# EAGLE schematic driver_3KW (EAGLE 6.2)

## Sheet 1 of 2
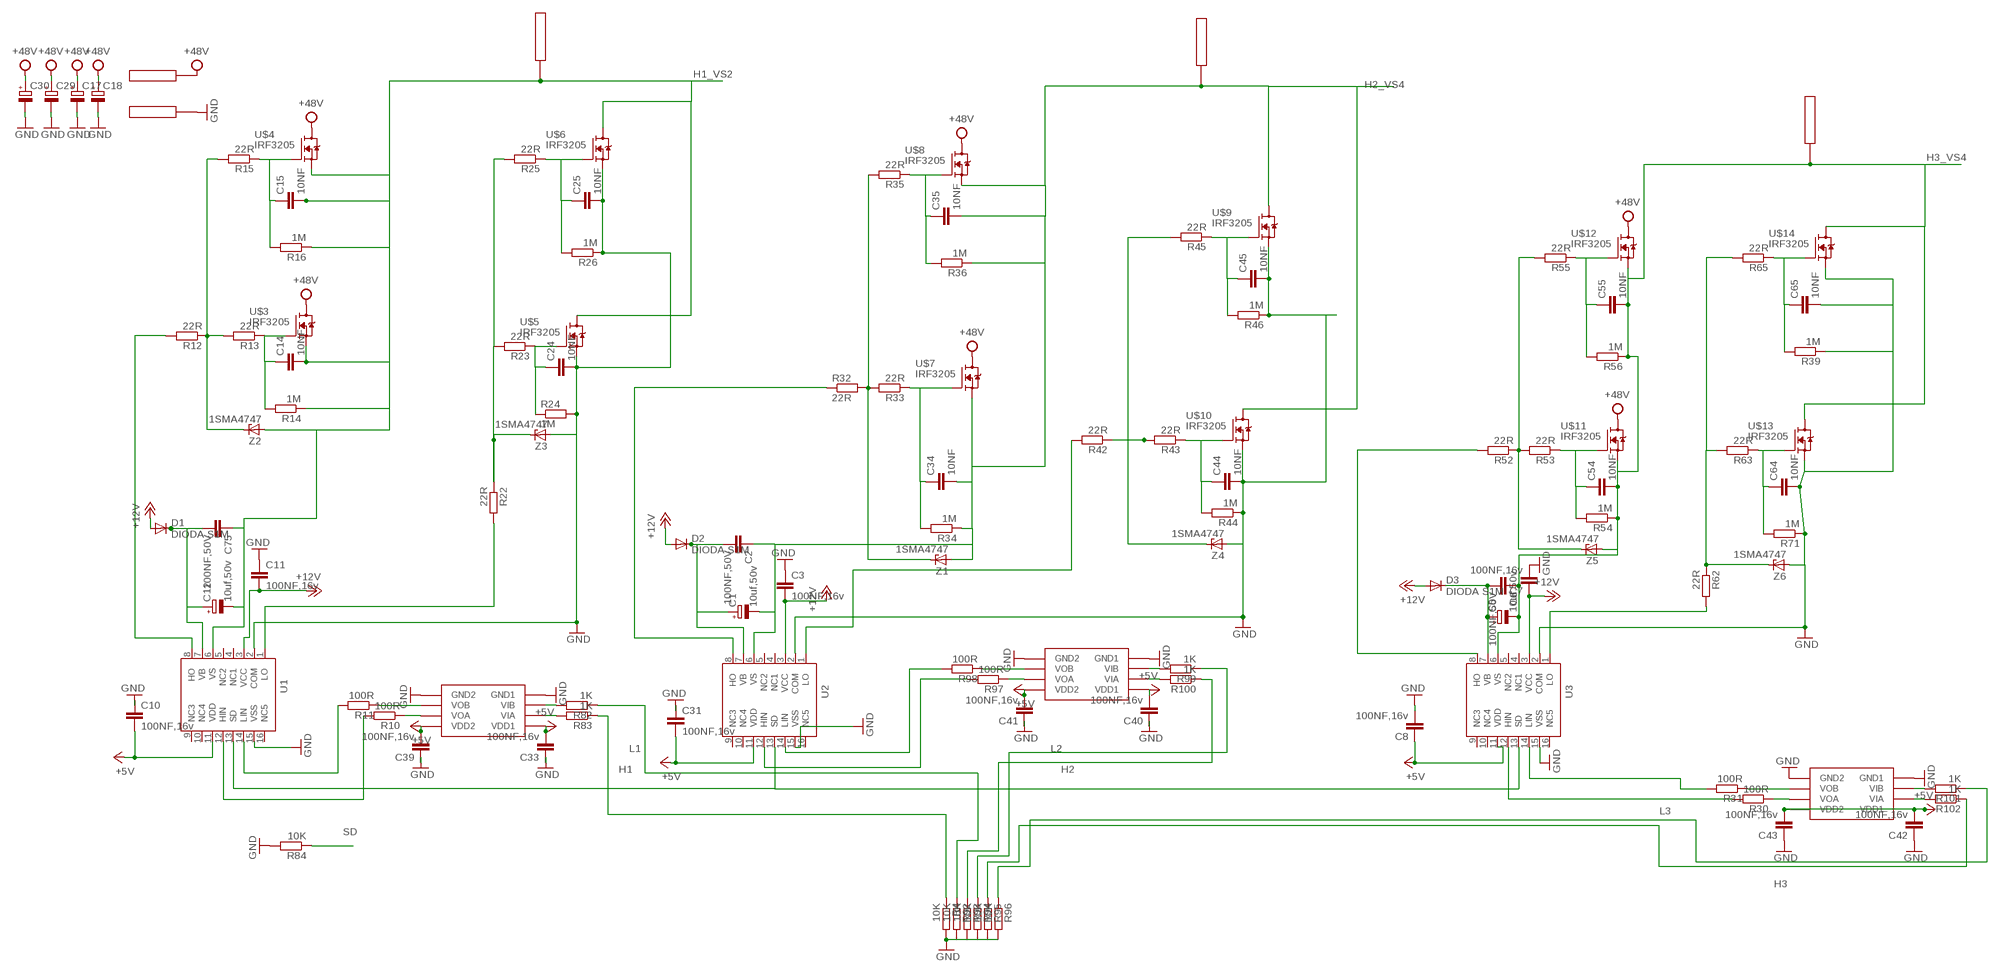
[diagram p0: schematic, sheet 1, part 1 of 2]
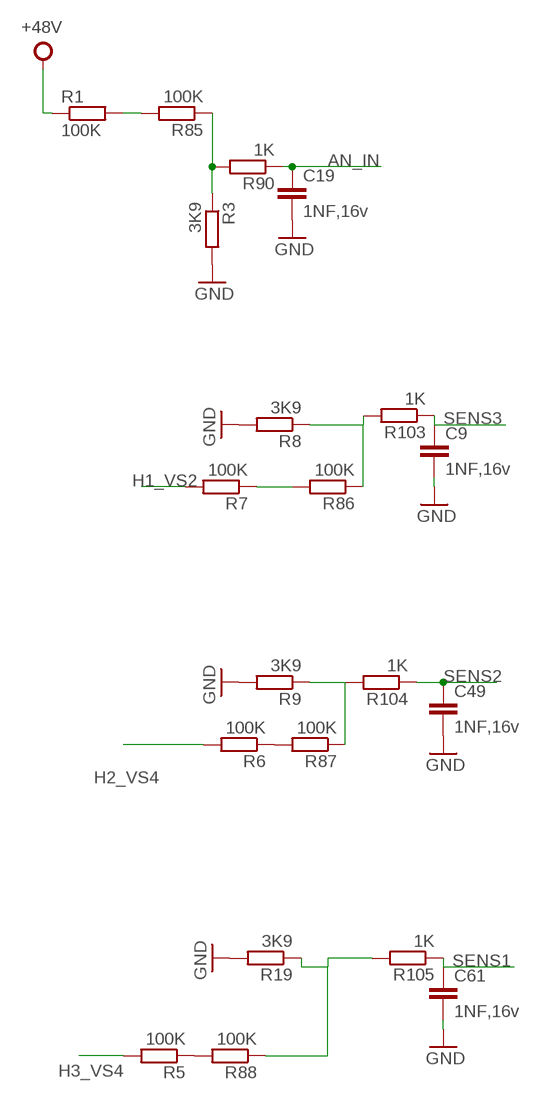
[diagram p1: schematic, sheet 1, part 2 of 2]

### Parts
C1  10uf,50v  CPOL-EUE2.5-5  [E2,5-5]
C2  100NF,50V  C_0805  [C_0805]
C3  100NF,16v  C_0805  [C_0805]
C5  10uf,50v  CPOL-EUE2.5-5  [E2,5-5]
C6  100NF,50V  C_0805  [C_0805]
C7  100NF,16v  C_0805  [C_0805]
C8  100NF,16v  C_0805  [C_0805]
C9  1NF,16v  C_0805  [C_0805]
C10  100NF,16v  C_0805  [C_0805]
C11  100NF,16v  C_0805  [C_0805]
C12  10uf,50v  CPOL-EUE2.5-5  [E2,5-5]
C14  10NF  C_0805  [C_0805]
C15  10NF  C_0805  [C_0805]
C17  CPOL-EUE7.5-16  [E7,5-16]
C18  CPOL-EUE7.5-16  [E7,5-16]
C19  1NF,16v  C_0805  [C_0805]
C24  10NF  C_0805  [C_0805]
C25  10NF  C_0805  [C_0805]
C29  CPOL-EUE7.5-16  [E7,5-16]
C30  CPOL-EUE7.5-16  [E7,5-16]
C31  100NF,16v  C_0805  [C_0805]
C33  100NF,16v  C_0805  [C_0805]
C34  10NF  C_0805  [C_0805]
C35  10NF  C_0805  [C_0805]
C39  100NF,16v  C_0805  [C_0805]
C40  100NF,16v  C_0805  [C_0805]
C41  100NF,16v  C_0805  [C_0805]
C42  100NF,16v  C_0805  [C_0805]
C43  100NF,16v  C_0805  [C_0805]
C44  10NF  C_0805  [C_0805]
C45  10NF  C_0805  [C_0805]
C49  1NF,16v  C_0805  [C_0805]
C54  10NF  C_0805  [C_0805]
C55  10NF  C_0805  [C_0805]
C61  1NF,16v  C_0805  [C_0805]
C64  10NF  C_0805  [C_0805]
C65  10NF  C_0805  [C_0805]
C75  100NF,50V  C_0805  [C_0805]
D1  DIODA S1M  DIODE-DO-214AC  [DO-214AC]
D2  DIODA S1M  DIODE-DO-214AC  [DO-214AC]
D3  DIODA S1M  DIODE-DO-214AC  [DO-214AC]
R1  100K  R-EU_R1206X  [1206X]
R3  3K9  R-EU_R1206X  [1206X]
R4  10K  R_EU  [R_0805]
R5  100K  R-EU_R1206X  [1206X]
R6  100K  R-EU_R1206X  [1206X]
R7  100K  R-EU_R1206X  [1206X]
R8  3K9  R-EU_R1206X  [1206X]
R9  3K9  R-EU_R1206X  [1206X]
R10  100R  R_EU  [R_0805]
R11  100R  R_EU  [R_0805]
R12  22R  R-EU_1210X  [1210X]
R13  22R  R-EU_1210X  [1210X]
R14  1M  R-EU_R1206X  [1206X]
R15  22R  R-EU_1210X  [1210X]
R16  1M  R-EU_R1206X  [1206X]
R19  3K9  R-EU_R1206X  [1206X]
R22  22R  R-EU_1210X  [1210X]
R23  22R  R-EU_1210X  [1210X]
R24  1M  R-EU_R1206X  [1206X]
R25  22R  R-EU_1210X  [1210X]
R26  1M  R-EU_R1206X  [1206X]
R30  100R  R_EU  [R_0805]
R31  100R  R_EU  [R_0805]
R32  22R  R-EU_1210X  [1210X]
R33  22R  R-EU_1210X  [1210X]
R34  1M  R-EU_R1206X  [1206X]
R35  22R  R-EU_1210X  [1210X]
R36  1M  R-EU_R1206X  [1206X]
R39  1M  R-EU_R1206X  [1206X]
R42  22R  R-EU_1210X  [1210X]
R43  22R  R-EU_1210X  [1210X]
R44  1M  R-EU_R1206X  [1206X]
R45  22R  R-EU_1210X  [1210X]
R46  1M  R-EU_R1206X  [1206X]
R52  22R  R-EU_1210X  [1210X]
R53  22R  R-EU_1210X  [1210X]
R54  1M  R-EU_R1206X  [1206X]
R55  22R  R-EU_1210X  [1210X]
R56  1M  R-EU_R1206X  [1206X]
R62  22R  R-EU_1210X  [1210X]
R63  22R  R-EU_1210X  [1210X]
R65  22R  R-EU_1210X  [1210X]
R71  1M  R-EU_R1206X  [1206X]
R82  1K  R_EU  [R_0805]
R83  1K  R_EU  [R_0805]
R84  10K  R_EU  [R_0805]
R85  100K  R-EU_R1206X  [1206X]
R86  100K  R-EU_R1206X  [1206X]
R87  100K  R-EU_R1206X  [1206X]
R88  100K  R-EU_R1206X  [1206X]
R90  1K  R-EU_R1206X  [1206X]
R92  10K  R_EU  [R_0805]
R93  10K  R_EU  [R_0805]
R94  10K  R_EU  [R_0805]
R95  10K  R_EU  [R_0805]
R96  10K  R_EU  [R_0805]
R97  100R  R_EU  [R_0805]
R98  100R  R_EU  [R_0805]
R99  1K  R_EU  [R_0805]
R100  1K  R_EU  [R_0805]
R101  1K  R_EU  [R_0805]
R102  1K  R_EU  [R_0805]
R103  1K  R-EU_R1206X  [1206X]
R104  1K  R-EU_R1206X  [1206X]
R105  1K  R-EU_R1206X  [1206X]
U1  IRS2110  MAX3043CWE  [SO16L]
U2  IRS2110  MAX3043CWE  [SO16L]
U3  IRS2110  MAX3043CWE  [SO16L]
U4  ADUM1200  [SO8]
U5  ADUM1200  [SO8]
U6  ADUM1200  [SO8]
U$3  IRF3205  [TO220AB]
U$4  IRF3205  [TO220AB]
U$5  IRF3205  [TO220AB]
U$6  IRF3205  [TO220AB]
U$7  IRF3205  [TO220AB]
U$8  IRF3205  [TO220AB]
U$9  IRF3205  [TO220AB]
U$10  IRF3205  [TO220AB]
U$11  IRF3205  [TO220AB]
U$12  IRF3205  [TO220AB]
U$13  IRF3205  [TO220AB]
U$14  IRF3205  [TO220AB]
U$15  PINOUT  [1DIP]
U$16  PINOUT  [1DIP]
U$17  PINOUT  [1DIP]
U$18  PINOUT  [1DIP]
U$19  PINOUT  [1DIP]
Z1  1SMA4747  ZENER-DIODESOD80C  [SOD80C@1]
Z2  1SMA4747  ZENER-DIODESOD80C  [SOD80C@1]
Z3  1SMA4747  ZENER-DIODESOD80C  [SOD80C@1]
Z4  1SMA4747  ZENER-DIODESOD80C  [SOD80C@1]
Z5  1SMA4747  ZENER-DIODESOD80C  [SOD80C@1]
Z6  1SMA4747  ZENER-DIODESOD80C  [SOD80C@1]

### Nets
+5V: C8.1 C10.2 C31.2 C33.2 C39.2 C40.2 C41.2 C42.2 C43.2 U1.11(VDD) U2.11(VDD) U3.11(VDD) U4.1(VDD1) U4.8(VDD2) U5.1(VDD1) U5.8(VDD2) U6.1(VDD1) U6.8(VDD2) ; also sheet 2
+12V: C3.2 C7.1 C11.2 D1.A D2.A D3.A U1.3(VCC) U2.3(VCC) U3.3(VCC) ; also sheet 2
+48V: C17.+ C18.+ C29.+ C30.+ R1.P$1 U$3.D U$4.D U$7.D U$8.D U$11.D U$12.D U$18.P$1
AN_IN: C19.1 R90.P$1 ; also sheet 2
GND: C3.1 C7.2 C8.2 C9.2 C10.1 C11.1 C17.- C18.- C19.2 C24.2 C25.2 C29.- C30.- C31.1 C33.1 C39.1 C40.1 C41.1 C42.1 C43.1 C44.2 C45.2 C49.2 C61.2 C64.2 C65.2 R3.P$2 R4.2 R8.P$2 R9.P$2 R19.P$2 R24.P$2 R26.P$1 R39.P$1 R44.P$1 R46.P$1 R71.P$1 R84.2 R92.2 R93.2 R94.2 R95.2 R96.2 U1.2(COM) U1.15(VSS) U2.2(COM) U2.15(VSS) U3.2(COM) U3.15(VSS) U4.4(GND1) U4.5(GND2) U5.4(GND1) U5.5(GND2) U6.4(GND1) U6.5(GND2) U$5.S U$6.S U$9.S U$10.S U$13.S U$14.S U$19.P$1 Z3.A Z4.A Z6.A ; also sheet 2
H1: R4.1 R83.1 ; also sheet 2
H1_VS2: C12.- C14.2 C15.2 C75.1 R7.P$2 R14.P$1 R16.P$1 U1.6(VS) U$3.S U$4.S U$5.D U$6.D U$15.P$1 Z2.A
H2: R93.1 R100.1 ; also sheet 2
H2_VS4: C1.- C2.1 C34.2 C35.2 R6.P$2 R34.P$1 R36.P$1 U2.6(VS) U$7.S U$8.S U$9.D U$10.D U$16.P$1 Z1.A
H3: R95.1 R102.1 ; also sheet 2
H3_VS4: C5.- C6.1 C54.2 C55.2 R5.P$2 R54.P$1 R56.P$1 U3.6(VS) U$11.S U$12.S U$13.D U$14.D U$17.P$1 Z5.A
L1: R82.1 R92.1 ; also sheet 2
L2: R94.1 R99.1 ; also sheet 2
L3: R96.1 R101.1 ; also sheet 2
N$1: R52.P$1 R53.P$2 R55.P$2 Z5.C
N$7: R9.P$1 R87.P$1 R104.P$2
N$12: C35.1 R35.P$1 R36.P$2 U$8.G
N$18: R3.P$1 R85.P$1 R90.P$2
N$21: C15.1 R15.P$1 R16.P$2 U$4.G
N$23: C25.1 R25.P$1 R26.P$2 U$6.G
N$26: C45.1 R45.P$1 R46.P$2 U$9.G
N$28: C55.1 R55.P$1 R56.P$2 U$12.G
N$30: C65.1 R39.P$2 R65.P$1 U$14.G
N$32: C14.1 R13.P$1 R14.P$2 U$3.G
N$33: R10.2 U1.12(HIN)
N$34: C24.1 R23.P$1 R24.P$1 U$5.G
N$36: C34.1 R33.P$1 R34.P$2 U$7.G
N$38: C44.1 R43.P$1 R44.P$2 U$10.G
N$40: C54.1 R53.P$1 R54.P$2 U$11.G
N$41: R8.P$1 R86.P$1 R103.P$2
N$42: C64.1 R63.P$1 R71.P$2 U$13.G
N$43: R19.P$1 R88.P$1 R105.P$2
N$44: R12.P$1 R13.P$2 R15.P$2 Z2.C
N$45: R62.P$1 R63.P$2 R65.P$2 Z6.C
N$47: R42.P$1 R43.P$2 R45.P$2 Z4.C
N$48: R32.P$2 R33.P$2 R35.P$2 Z1.C
N$49: R22.P$1 R23.P$2 R25.P$2 Z3.C
N$50: C12.+ C75.2 D1.C U1.7(VB)
N$51: R11.2 U1.14(LIN)
N$53: R22.P$2 U1.1(LO)
N$54: R12.P$2 U1.8(HO)
N$57: R11.1 U4.6(VOB)
N$58: C1.+ C2.2 D2.C U2.7(VB)
N$59: R42.P$2 U2.1(LO)
N$60: R32.P$1 U2.8(HO)
N$61: R97.2 U2.12(HIN)
N$62: R98.2 U2.14(LIN)
N$63: R10.1 U4.7(VOA)
N$64: R82.2 U4.3(VIB)
N$65: C5.+ C6.2 D3.C U3.7(VB)
N$66: R62.P$2 U3.1(LO)
N$67: R52.P$2 U3.8(HO)
N$69: R31.2 U3.14(LIN)
N$70: R83.2 U4.2(VIA)
N$71: R1.P$2 R85.P$2
N$72: R7.P$1 R86.P$2
N$73: R6.P$1 R87.P$2
N$74: R5.P$1 R88.P$2
N$80: R30.2 U3.12(HIN)
N$82: R31.1 U6.6(VOB)
N$83: R98.1 U5.6(VOB)
N$84: R97.1 U5.7(VOA)
N$85: R99.2 U5.3(VIB)
N$86: R100.2 U5.2(VIA)
N$87: R30.1 U6.7(VOA)
N$88: R101.2 U6.3(VIB)
N$89: R102.2 U6.2(VIA)
SD: R84.1 U1.13(SD) U2.13(SD) U3.13(SD)
SENS1: C61.1 R105.P$1 ; also sheet 2
SENS2: C49.1 R104.P$1 ; also sheet 2
SENS3: C9.1 R103.P$1 ; also sheet 2
Unconnected: U1.4(NC1) U1.5(NC2) U1.9(NC3) U1.10(NC4) U1.16(NC5) U2.4(NC1) U2.5(NC2) U2.9(NC3) U2.10(NC4) U2.16(NC5) U3.4(NC1) U3.5(NC2) U3.9(NC3) U3.10(NC4) U3.16(NC5)

## Sheet 2 of 2
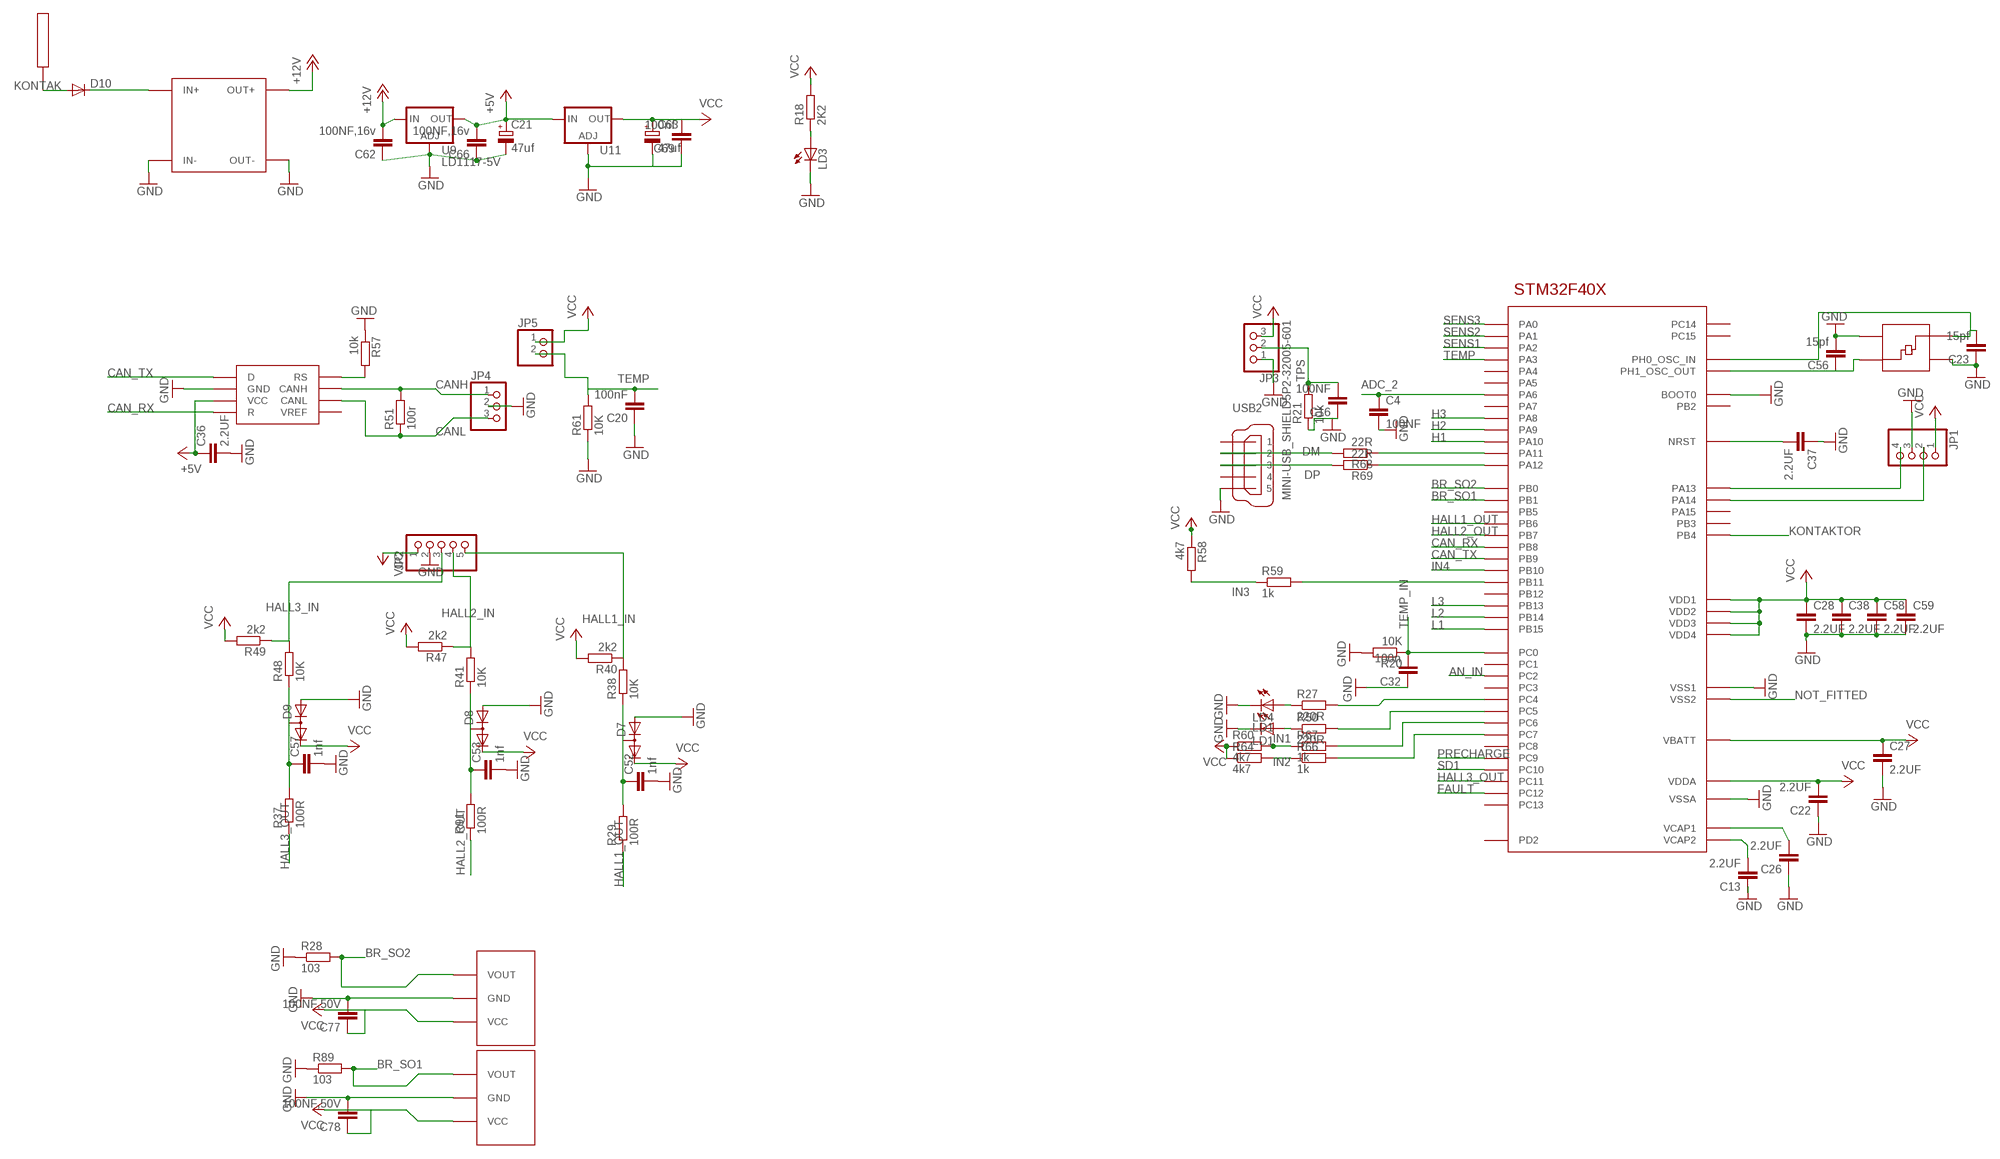
[diagram p2: schematic, sheet 2]

### Parts
C4  100NF  C_0805  [C_0805]
C13  2.2UF  C_0805  [C_0805]
C16  100NF  C_0805  [C_0805]
C20  100nF  C_0805  [C_0805]
C21  47uf  CPOL-EU153CLV-0605  [153CLV-0605]
C22  2.2UF  C_0805  [C_0805]
C23  15pf  C_0805  [C_0805]
C26  2.2UF  C_0805  [C_0805]
C27  2.2UF  C_0805  [C_0805]
C28  2.2UF  C_0805  [C_0805]
C32  100n  C_0805  [C_0805]
C36  2.2UF  C_0805  [C_0805]
C37  2.2UF  C_0805  [C_0805]
C38  2.2UF  C_0805  [C_0805]
C52  1nf  C_0805  [C_0805]
C53  1nf  C_0805  [C_0805]
C56  15pf  C_0805  [C_0805]
C57  1nf  C_0805  [C_0805]
C58  2.2UF  C_0805  [C_0805]
C59  2.2UF  C_0805  [C_0805]
C62  100NF,16v  C_0805  [C_0805]
C63  47uf  CPOL-EU153CLV-0605  [153CLV-0605]
C66  100NF,16v  C_0805  [C_0805]
C69  100nf  C_0805  [C_0805]
C77  100NF,50V  C_0805  [C_0805]
C78  100NF,50V  C_0805  [C_0805]
D7  DIODE_2CACA-SOT23  [SOT23]
D8  DIODE_2CACA-SOT23  [SOT23]
D9  DIODE_2CACA-SOT23  [SOT23]
D10  DIODE-SMB  [SMB]
JP1  PINHD-1X4  [1X04]
JP2  PINHD-1X5  [1X05]
JP3  PINHD-1X3  [1X03]
JP4  PINHD-1X3  [1X03]
JP5  PINHD-1X2  [1X02]
LD1  LED3MM  [LED3MM]
LD3  LED3MM  [LED3MM]
LD4  LD1  LED3MM  [LED3MM]
R18  2K2  R_EU  [R_0805]
R20  10K  R_EU  [R_0805]
R21  10k  R_EU  [R_0805]
R27  220R  R_EU  [R_0805]
R28  103  R_EU  [R_0805]
R29  100R  R_EU  [R_0805]
R37  100R  R_EU  [R_0805]
R38  10K  R_EU  [R_0805]
R40  2k2  R_EU  [R_0805]
R41  10K  R_EU  [R_0805]
R47  2k2  R_EU  [R_0805]
R48  10K  R_EU  [R_0805]
R49  2k2  R_EU  [R_0805]
R50  220R  R_EU  [R_0805]
R51  100r  R_EU  [R_0805]
R57  10k  R_EU  [R_0805]
R58  4k7  R_EU  [R_0805]
R59  1k  R_EU  [R_0805]
R60  4k7  R_EU  [R_0805]
R61  10K  R_EU  [R_0805]
R64  4k7  R_EU  [R_0805]
R66  1k  R_EU  [R_0805]
R67  1k  R_EU  [R_0805]
R68  22R  R_EU  [R_0805]
R69  22R  R_EU  [R_0805]
R89  103  R_EU  [R_0805]
R91  100R  R_EU  [R_0805]
U9  LD1117-5V  LM317MABDT  [DPACK@1]
U11  LM317MABDT  [DPACK@1]
U73  MCP2551  SN65HVD230  [SN65HVD230]
U$1  LM2596  [DC-DC]
U$2  STM32F40X  [DIP64]
U$20  L01Z400S05  [L01ZXXXS05]
U$21  L01Z400S05  [L01ZXXXS05]
U$22  PINOUT  [1DIP]
USB2  MINI-USB_SHIELD5P2-32005-601  [32005-601]
X2  UBM  [UBM]

### Nets
+5V: C21.+ C36.1 C66.2 U9.4(OUT) U11.3(IN) U73.P$3(VCC) ; also sheet 1
+12V: C62.2 U9.3(IN) U$1.OUT+ ; also sheet 1
ADC_2: C4.1 U$2.P$31(PA6)
AN_IN: U$2.P$10(PC2) ; also sheet 1
BR_SO1: R89.2 U$2.P$36(PB1) U$21.1(VOUT)
BR_SO2: R28.2 U$2.P$35(PB0) U$20.1(VOUT)
CAN_RX: U73.P$4(R) U$2.P$97(PB8)
CAN_TX: U73.P$1(D) U$2.P$98(PB9)
CANH: JP4.1 R51.2 U73.P$7(CANH)
CANL: JP4.3 R51.1 U73.P$6(CANL)
DM: R68.2 USB2.2
DP: R69.2 USB2.3
FAULT: U$2.P$89(PC12)
GND: C4.2 C13.1 C16.1 C20.1 C21.- C22.1 C23.1 C26.1 C27.2 C28.2 C32.1 C36.2 C37.1 C38.2 C52.2 C53.2 C56.2 C57.2 C58.2 C59.2 C62.1 C63.- C66.1 C69.1 C77.2 C78.2 D7.1(A) D8.1(A) D9.1(A) JP1.3 JP2.2 JP3.1 JP4.2 LD1.K(C) LD3.K(C) LD4.K(C) R20.2 R21.1 R28.1 R57.1 R61.1 R89.1 U9.1(ADJ) U11.1(ADJ) U73.P$2(GND) U$1.IN- U$1.OUT- U$2.P$12(VSSA) U$2.P$27(VSS1) U$2.P$96(BOOT0) U$20.2(GND) U$21.2(GND) USB2.5 X2.2 X2.4 ; also sheet 1
H1: U$2.P$70(PA10) ; also sheet 1
H2: U$2.P$69(PA9) ; also sheet 1
H3: U$2.P$68(PA8) ; also sheet 1
HALL1_IN: JP2.5 R38.2 R40.1
HALL1_OUT: R29.1 U$2.P$94(PB6)
HALL2_IN: JP2.4 R41.2 R47.1
HALL2_OUT: R91.1 U$2.P$95(PB7)
HALL3_IN: JP2.3 R48.2 R49.1
HALL3_OUT: R37.1 U$2.P$88(PC11)
IN1: R60.2 R67.1
IN2: R64.2 R66.1
IN3: R58.2 R59.1
IN4: U$2.P$38(PB10)
KONTAK: D10.A U$22.P$1
KONTAKTOR: U$2.P$92(PB4)
L1: U$2.P$63(PB15) ; also sheet 1
L2: U$2.P$62(PB14) ; also sheet 1
L3: U$2.P$61(PB13) ; also sheet 1
LD1: LD1.A R50.1
N$3: C37.2 U$2.P$7(NRST)
N$4: LD4.A R27.1
N$5: R50.2 U$2.P$34(PC5)
N$6: LD3.A R18.1
N$8: C56.1 U$2.P$6(PH1_OSC_OUT) X2.1
N$9: C26.2 U$2.P$40(VCAP1)
N$10: R68.1 U$2.P$71(PA11)
N$11: C13.2 U$2.P$74(VCAP2)
N$13: C23.2 U$2.P$5(PH0_OSC_IN) X2.3
N$14: R57.2 U73.P$8(RS)
N$15: R27.2 U$2.P$33(PC4)
N$16: R59.2 U$2.P$39(PB11)
N$17: D10.C U$1.IN+
N$19: R67.2 U$2.P$64(PC6)
N$22: R66.2 U$2.P$65(PC7)
N$25: R69.1 U$2.P$72(PA12)
N$98: C52.1 D7.3(AC) R29.2 R38.1
N$99: C53.1 D8.3(AC) R41.1 R91.2
N$100: C57.1 D9.3(AC) R37.2 R48.1
NOT_FITTED: U$2.P$17(VSS2)
PRECHARGE: U$2.P$67(PC9)
SD1: U$2.P$87(PC10)
SENS1: U$2.P$16(PA2) ; also sheet 1
SENS2: U$2.P$15(PA1) ; also sheet 1
SENS3: U$2.P$14(PA0) ; also sheet 1
SWDCLK1: JP1.2 U$2.P$85(PA14)
SWDIO1: JP1.4 U$2.P$73(PA13)
TEMP: C20.2 JP5.2 R61.2 U$2.P$26(PA3)
TEMP_IN: C32.2 R20.1 U$2.P$8(PC0)
TPS: C16.2 JP3.2 R21.2
VDD: C22.2 C27.1 C28.1 C38.1 C58.1 C59.1 C63.+ C69.2 C77.1 C78.1 D7.2(C) D8.2(C) D9.2(C) JP1.1 JP2.1 JP3.3 JP5.1 R18.2 R40.2 R47.2 R49.2 R58.1 R60.1 R64.1 U11.4(OUT) U$2.P$1(VBATT) U$2.P$13(VDDA) U$2.P$28(VDD4) U$2.P$41(VDD2) U$2.P$75(VDD3) U$2.P$100(VDD1) U$20.3(VCC) U$21.3(VCC) ; supply symbol labelled VCC
Unconnected: U73.P$5(VREF) U$2.P$2(PC13) U$2.P$3(PC14) U$2.P$4(PC15) U$2.P$9(PC1) U$2.P$11(PC3) U$2.P$29(PA4) U$2.P$30(PA5) U$2.P$32(PA7) U$2.P$37(PB2) U$2.P$60(PB12) U$2.P$66(PC8) U$2.P$86(PA15) U$2.P$90(PD2) U$2.P$91(PB3) U$2.P$93(PB5) USB2.1 USB2.4 USB2.M1(S1) USB2.M2(S2)

## Library data of the parts
C1 C5 C12 C17 C18 C21 C29 C30 C63 = resistor:CPOL-EU: POLARIZED CAPACITOR, European symbol
C2-C4 C6-C11 C13-C16 C19 C20 C22-C28 C31-C45 C49 C52-C59 C61 C62 C64-C66 C69 C75 C77 C78 = IVC:C_0805
D1-D3 D10 = diode:DIODE-: DIODE
D7-D9 = diode:DIODE_2CACA-: 2 Diodes - Cathode-Anode|Cathode-Anode
JP1 = pinhead:PINHD-1X4: PIN HEADER
JP2 = pinhead:PINHD-1X5: PIN HEADER
JP3 JP4 = pinhead:PINHD-1X3: PIN HEADER
JP5 = pinhead:PINHD-1X2: PIN HEADER
LD1 LD3 LD4 = led:LED: LED OSRAM: - CHIPLED LG R971, LG N971, LY N971, LG Q971, LY Q971, LO R971, LY R971 LH N974, LH R974 LS Q976, LO Q976, LY Q976 LO Q996 - Hyper CHIPLED LW Q18S LB Q993, LB Q99A, LB R99A - SideLED LS A670, LO A670, LY A670, LG A670, LP A670 LB A673, LV A673, LT A673, LW A673 LH A674 LY A675 LS A676, LA A676, LO A676, LY A676, LW A676 LS A679, LY A679, LG A679 - Hyper Micro SIDELED® LS Y876, LA Y876, LO Y876, LY Y876 LT Y87S - SmartLED LW L88C, LW L88S LB L89C, LB L89S, LG L890 LS L89K, LO L89K, LY L89K LS L896, LA L896, LO L896, LY L896 - TOPLED LS T670, LO T670, LY T670, LG T670, LP T670 LSG T670, LSP T670, LSY T670, LOP T670, LYG T670 LG T671, LOG T671, LSG T671 LB T673, LV T673, LT T673, LW T673 LH T674 LS T676, LA T676, LO T676, LY T676, LB T676, LH T676, LSB T676, LW T676 LB T67C, LV T67C, LT T67C, LS T67K, LO T67K, LY T67K, LW E67C LS E67B, LA E67B, LO E67B, LY E67B, LB E67C, LV E67C, LT E67C LW T67C LS T679, LY T679, LG T679 LS T770, LO T770, LY T770, LG T770, LP T770 LB T773, LV T773, LT T773, LW T773 LH T774 LS E675, LA E675, LY E675, LS T675 LS T776, LA T776, LO T776, LY T776, LB T776 LHGB T686 LT T68C, LB T68C - Hyper Mini TOPLED® LB M676 - Mini TOPLED Santana® LG M470 LS M47K, LO M47K, LY M47K Source: http://www.osram.convergy.de LUXEON: - LUMILED® LXK2-PW12-R00, LXK2-PW12-S00, LXK2-PW14-U00, LXK2-PW14-V00 LXK2-PM12-R00, LXK2-PM12-S00, LXK2-PM14-U00 LXK2-PE12-Q00, LXK2-PE12-R00, LXK2-PE12-S00, LXK2-PE14-T00, LXK2-PE14-U00 LXK2-PB12-K00, LXK2-PB12-L00, LXK2-PB12-M00, LXK2-PB14-N00, LXK2-PB14-P00, LXK2-PB14-Q00 LXK2-PR12-L00, LXK2-PR12-M00, LXK2-PR14-Q00, LXK2-PR14-R00 LXK2-PD12-Q00, LXK2-PD12-R00, LXK2-PD12-S00 LXK2-PH12-R00, LXK2-PH12-S00 LXK2-PL12-P00, LXK2-PL12-Q00, LXK2-PL12-R00 Source: www.luxeon.com KINGBRIGHT: KA-3528ASYC Source: www.kingbright.com
R1 R3 R5-R9 R12-R16 R19 R22-R26 R32-R36 R39 R42-R46 R52-R56 R62 R63 R65 R71 R85-R88 R90 R103-R105 = resistor:R-EU_: RESISTOR, European symbol
R4 R10 R11 R18 R20 R21 R27-R31 R37 R38 R40 R41 R47-R51 R57-R61 R64 R66-R69 R82-R84 R89 R91-R102 = IVC:R_EU
U1-U3 = maxim:MAX304*: ±10kV ESD-Protected, Quad 5V RS-485/422 Transmitters Source: MAX3040-MAX3045.pdf
U4-U6 = analog-devices:ADUM1200
U9 U11 = v-reg:LM317?*: 500 mA Adjustable Output Positive Voltage Regulator Source: http://www.onsemi.co.jp .. LM317M-D.PDF
U73 = sn65hvd230:SN65HVD230
U$1 = tugasS3:LM2596
U$2 = stm32f4-dip:STM32F40X
U$3-U$14 = tugasS3:IRF3205
U$15-U$19 U$22 = tugasS3:PINOUT
U$20 U$21 = tugasS3:L01Z400S05
USB2 = con-cypressindustries:MINI-USB_SHIELD5P2-: MINI USB-B R/A DIP 5pol. Source: www.cypressindustries.com
X2 = crystal:UBM
Z1-Z6 = diode:ZENER-DIODE: Z-Diode